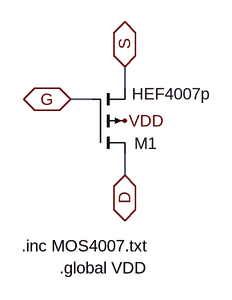
[diagram p0: schematic PMOSX.asc]
PMOSX.asc, the LTspice schematic file:
Version 4
SHEET 1 2472 680
WIRE -912 -240 -912 -272
WIRE -960 -224 -992 -224
WIRE -912 -112 -912 -144
FLAG -992 -224 G
IOPIN -992 -224 BiDir
FLAG -912 -272 S
IOPIN -912 -272 BiDir
FLAG -912 -112 D
IOPIN -912 -112 BiDir
FLAG -912 -192 VDD
SYMBOL pmos4 -960 -144 M180
WINDOW 0 62 15 Left 2
WINDOW 3 59 88 Left 2
SYMATTR InstName M1
SYMATTR Value HEF4007p
TEXT -1064 -8 Left 2 !.inc MOS4007.txt
TEXT -1008 24 Left 2 !.global VDD

The netlist it stands for:
* PMOSX.asc
M1 D G S VDD HEF4007p
.model NMOS NMOS
.model PMOS PMOS
.lib standard.mos
.inc MOS4007.txt
.global VDD
.backanno
.end